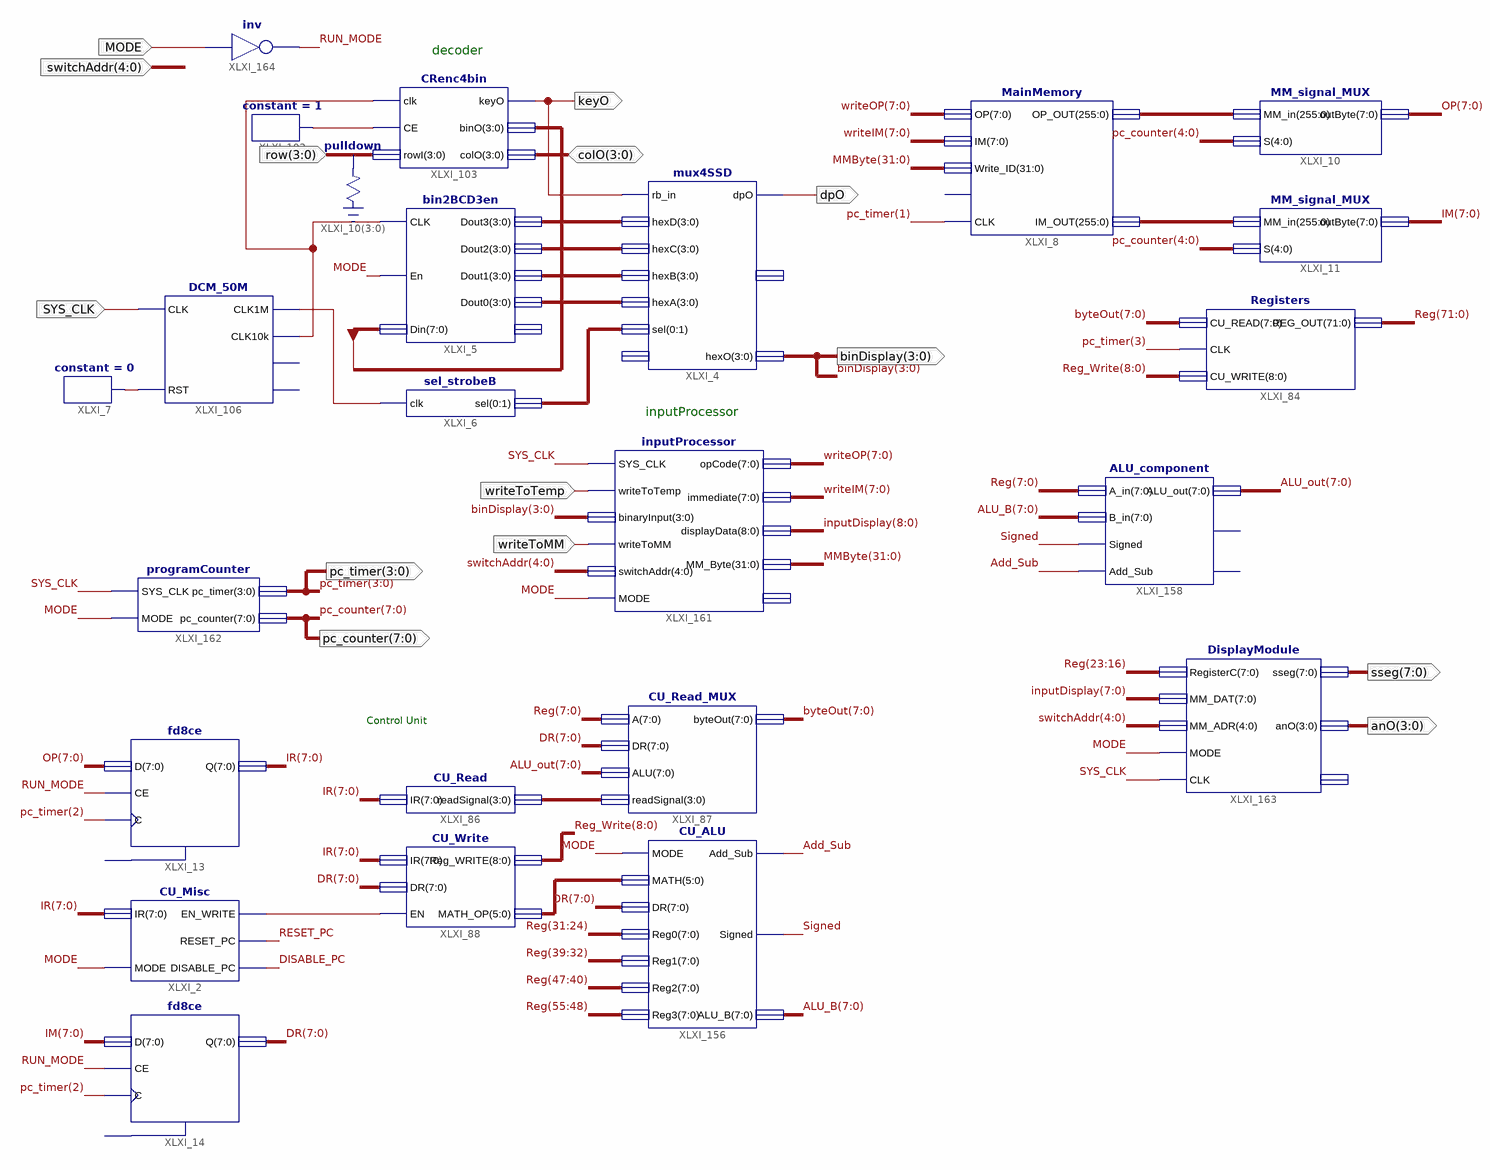
[diagram p0: schematic sheet 1]
// Xilinx ISE schematic minisculComputer.sch (spartan3e) as structural Verilog: 24 symbols, 14 ports
module minisculComputer (
  input  MODE,
  input  SYS_CLK,
  input  [3:0] row,
  input  [4:0] switchAddr,
  input  writeToTemp,
  input  writeToMM,
  inout  [3:0] colO,
  output [3:0] binDisplay,
  output keyO,
  output dpO,
  output [3:0] pc_timer,
  output [7:0] pc_counter,
  output [7:0] sseg,
  output [3:0] anO
);

  wire Add_Sub, constant1ToCE, DISABLE_PC, RESET_PC, RUN_MODE, Signed, XLXN_5, XLXN_6, XLXN_7, XLXN_57;
  wire [1:0] XLXN_14;
  wire [3:0] XLXN_3, XLXN_9, XLXN_10, XLXN_11, XLXN_13;
  wire [5:0] XLXN_4;
  wire [7:0] ALU_B, ALU_out, binO, byteOut, DR, IM, IR, OP, writeIM, writeOP;
  wire [8:0] inputDisplay, Reg_Write;
  wire [31:0] MMByte;
  wire [71:0] Reg;
  wire [255:0] XLXN_44, XLXN_69;

  MainMemory XLXI_8 (
    .OP(writeOP), .IM(writeIM), .Write_ID(MMByte), .CLK(pc_timer[1]), .OP_OUT(XLXN_44), .IM_OUT(XLXN_69));  // open: CLR
  MM_signal_MUX XLXI_10 (.MM_in(XLXN_44), .S(pc_counter[4:0]), .outByte(OP));
  MM_signal_MUX XLXI_11 (.MM_in(XLXN_69), .S(pc_counter[4:0]), .outByte(IM));
  Registers XLXI_84 (.CU_READ(byteOut), .CLK(pc_timer[3]), .CU_WRITE(Reg_Write), .REG_OUT(Reg));
  DCM_50M XLXI_106 (.CLK(SYS_CLK), .RST(XLXN_7), .CLK1M(XLXN_6), .CLK10k(XLXN_5));  // open: CLK1k, CLK1
  constant #(.CValue("0")) XLXI_7 (.O(XLXN_7));
  sel_strobeB XLXI_6 (.clk(XLXN_6), .sel({XLXN_14[0], XLXN_14[1]}));
  mux4SSD XLXI_4 (
    .rb_in(keyO), .hexD(XLXN_9), .hexC(XLXN_10), .hexB(XLXN_11), .hexA(XLXN_13),
    .sel({XLXN_14[0], XLXN_14[1]}), .dpO(dpO), .hexO(binDisplay));  // open: dp_in, anO
  bin2BCD3en XLXI_5 (
    .CLK(XLXN_5), .En(MODE), .Din(binO), .Dout3(XLXN_9), .Dout2(XLXN_10), .Dout1(XLXN_11), .Dout0(XLXN_13));  // open: RBout
  constant #(.CValue("1")) XLXI_102 (.O(constant1ToCE));
  CRenc4bin XLXI_103 (.clk(XLXN_5), .CE(constant1ToCE), .rowI(row), .keyO(keyO), .binO(binO[3:0]), .colO(colO));
  \pulldown  XLXI_10_dup2[3:0] (.O(row));
  CU_Misc XLXI_2 (.IR(IR), .MODE(MODE), .EN_WRITE(XLXN_57), .RESET_PC(RESET_PC), .DISABLE_PC(DISABLE_PC));
  fd8ce XLXI_14 (.C(pc_timer[2]), .CE(RUN_MODE), .D(IM), .Q(DR));  // open: CLR
  fd8ce XLXI_13 (.C(pc_timer[2]), .CE(RUN_MODE), .D(OP), .Q(IR));  // open: CLR
  CU_Read XLXI_86 (.IR(IR), .readSignal(XLXN_3));
  CU_Read_MUX XLXI_87 (.A(Reg[7:0]), .DR(DR), .ALU(ALU_out), .readSignal(XLXN_3), .byteOut(byteOut));
  CU_Write XLXI_88 (.IR(IR), .DR(DR), .EN(XLXN_57), .Reg_WRITE(Reg_Write), .MATH_OP(XLXN_4));
  CU_ALU XLXI_156 (
    .MODE(MODE), .MATH(XLXN_4), .DR(DR), .Reg0(Reg[31:24]), .Reg1(Reg[39:32]), .Reg2(Reg[47:40]),
    .Reg3(Reg[55:48]), .Add_Sub(Add_Sub), .Signed(Signed), .ALU_B(ALU_B));
  ALU_component XLXI_158 (
    .A_in(Reg[7:0]), .B_in(ALU_B), .Signed(Signed), .Add_Sub(Add_Sub), .ALU_out(ALU_out));  // open: Overflow, Carryout
  inputProcessor XLXI_161 (
    .SYS_CLK(SYS_CLK), .writeToTemp(writeToTemp), .binaryInput(binDisplay), .writeToMM(writeToMM),
    .switchAddr(switchAddr), .MODE(MODE), .opCode(writeOP), .immediate(writeIM), .displayData(inputDisplay),
    .MM_Byte(MMByte));  // open: temp
  programCounter XLXI_162 (.SYS_CLK(SYS_CLK), .MODE(MODE), .pc_timer(pc_timer), .pc_counter(pc_counter));
  DisplayModule XLXI_163 (
    .RegisterC(Reg[23:16]), .MM_DAT(inputDisplay[7:0]), .MM_ADR(switchAddr), .MODE(MODE), .CLK(SYS_CLK),
    .sseg(sseg), .anO(anO));  // open: lightOutput
  not XLXI_164 (RUN_MODE, MODE);

  // Notes on the sheet:
  //   decoder
  //   inputProcessor
  //   Control Unit
endmodule
